# Altium project 磁导航.PrjPCB
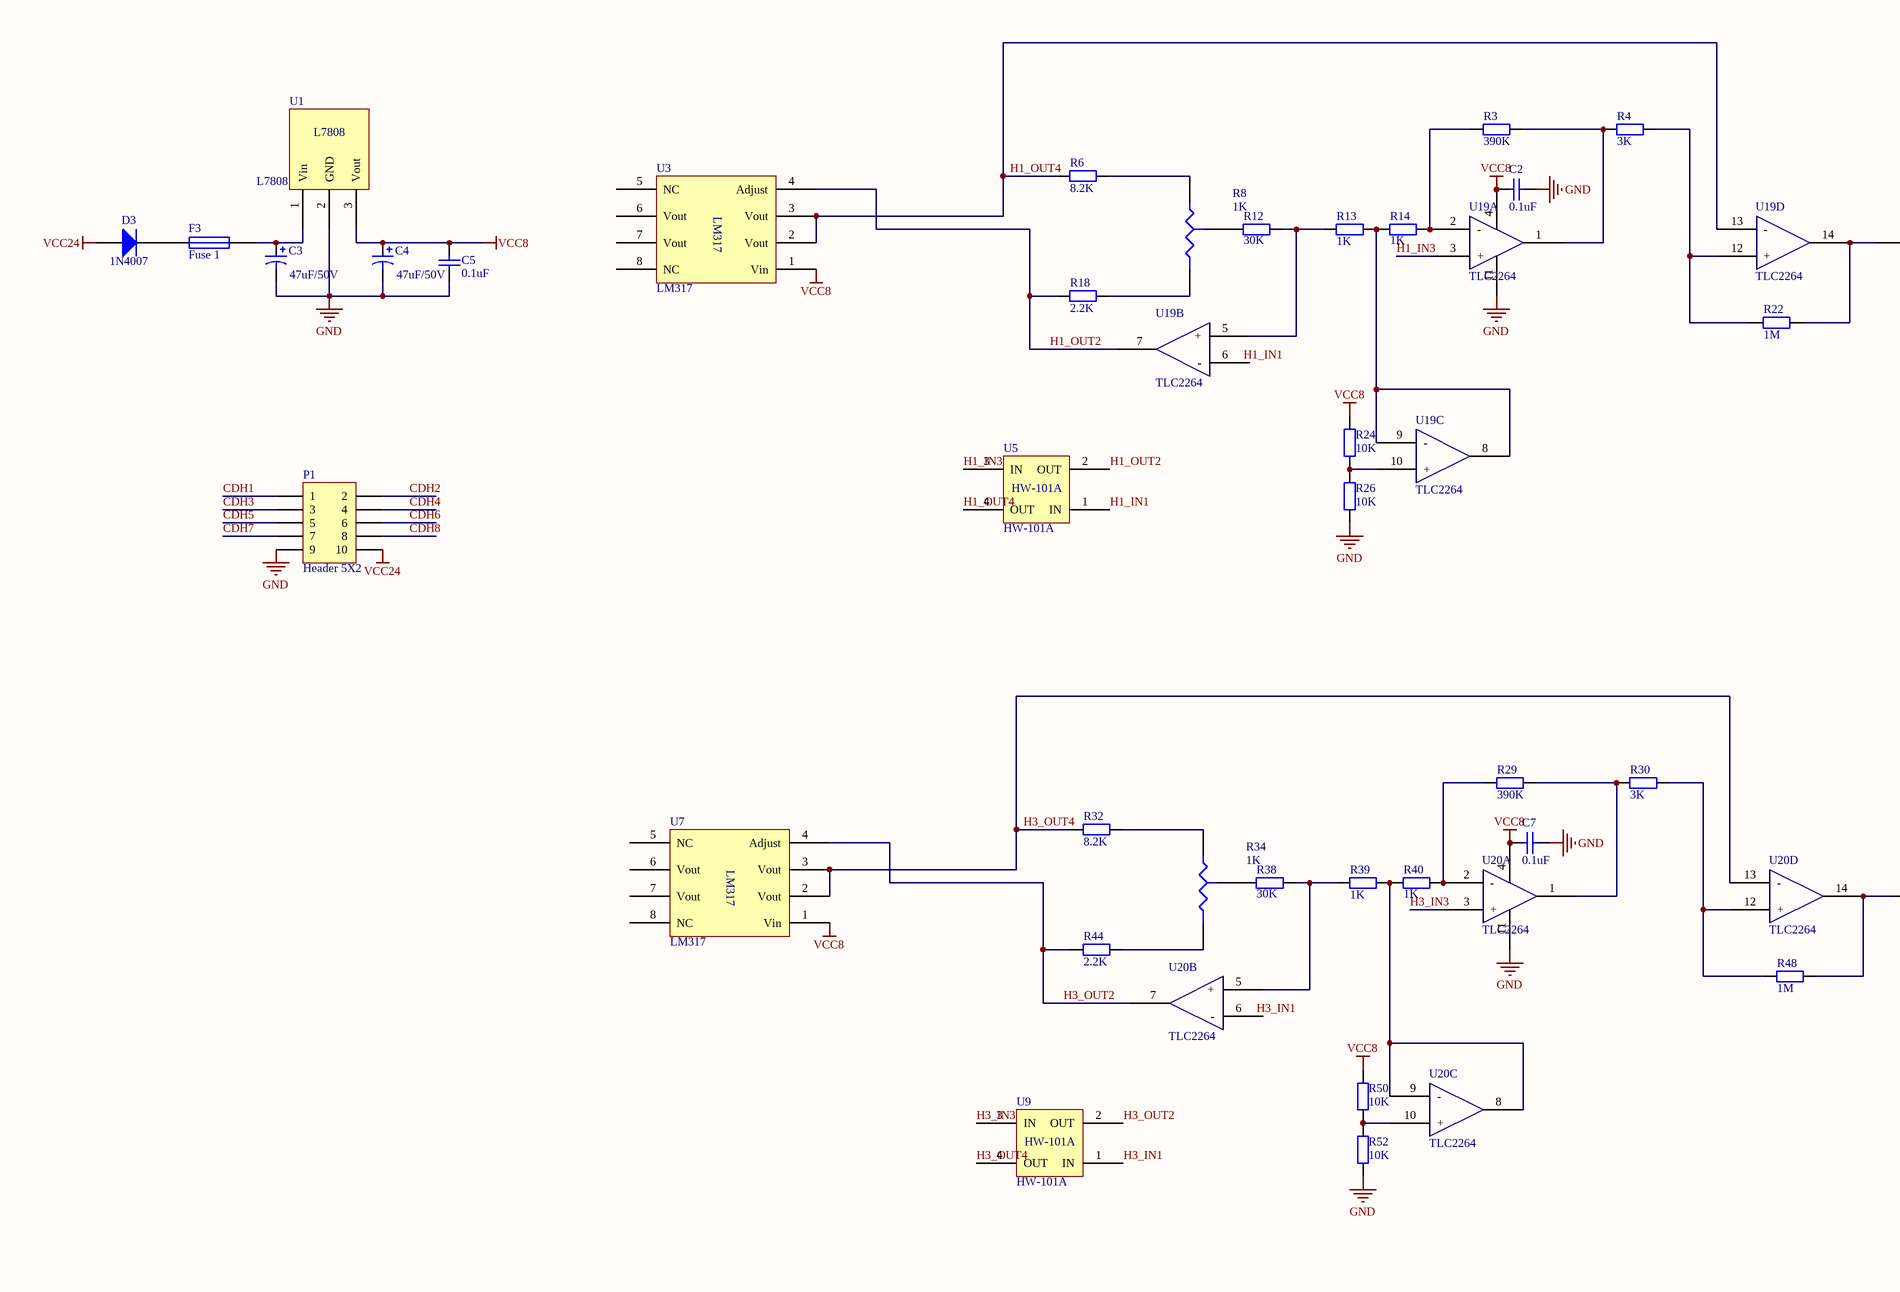
[diagram p0: 磁导航20161011.SchDoc, top left]
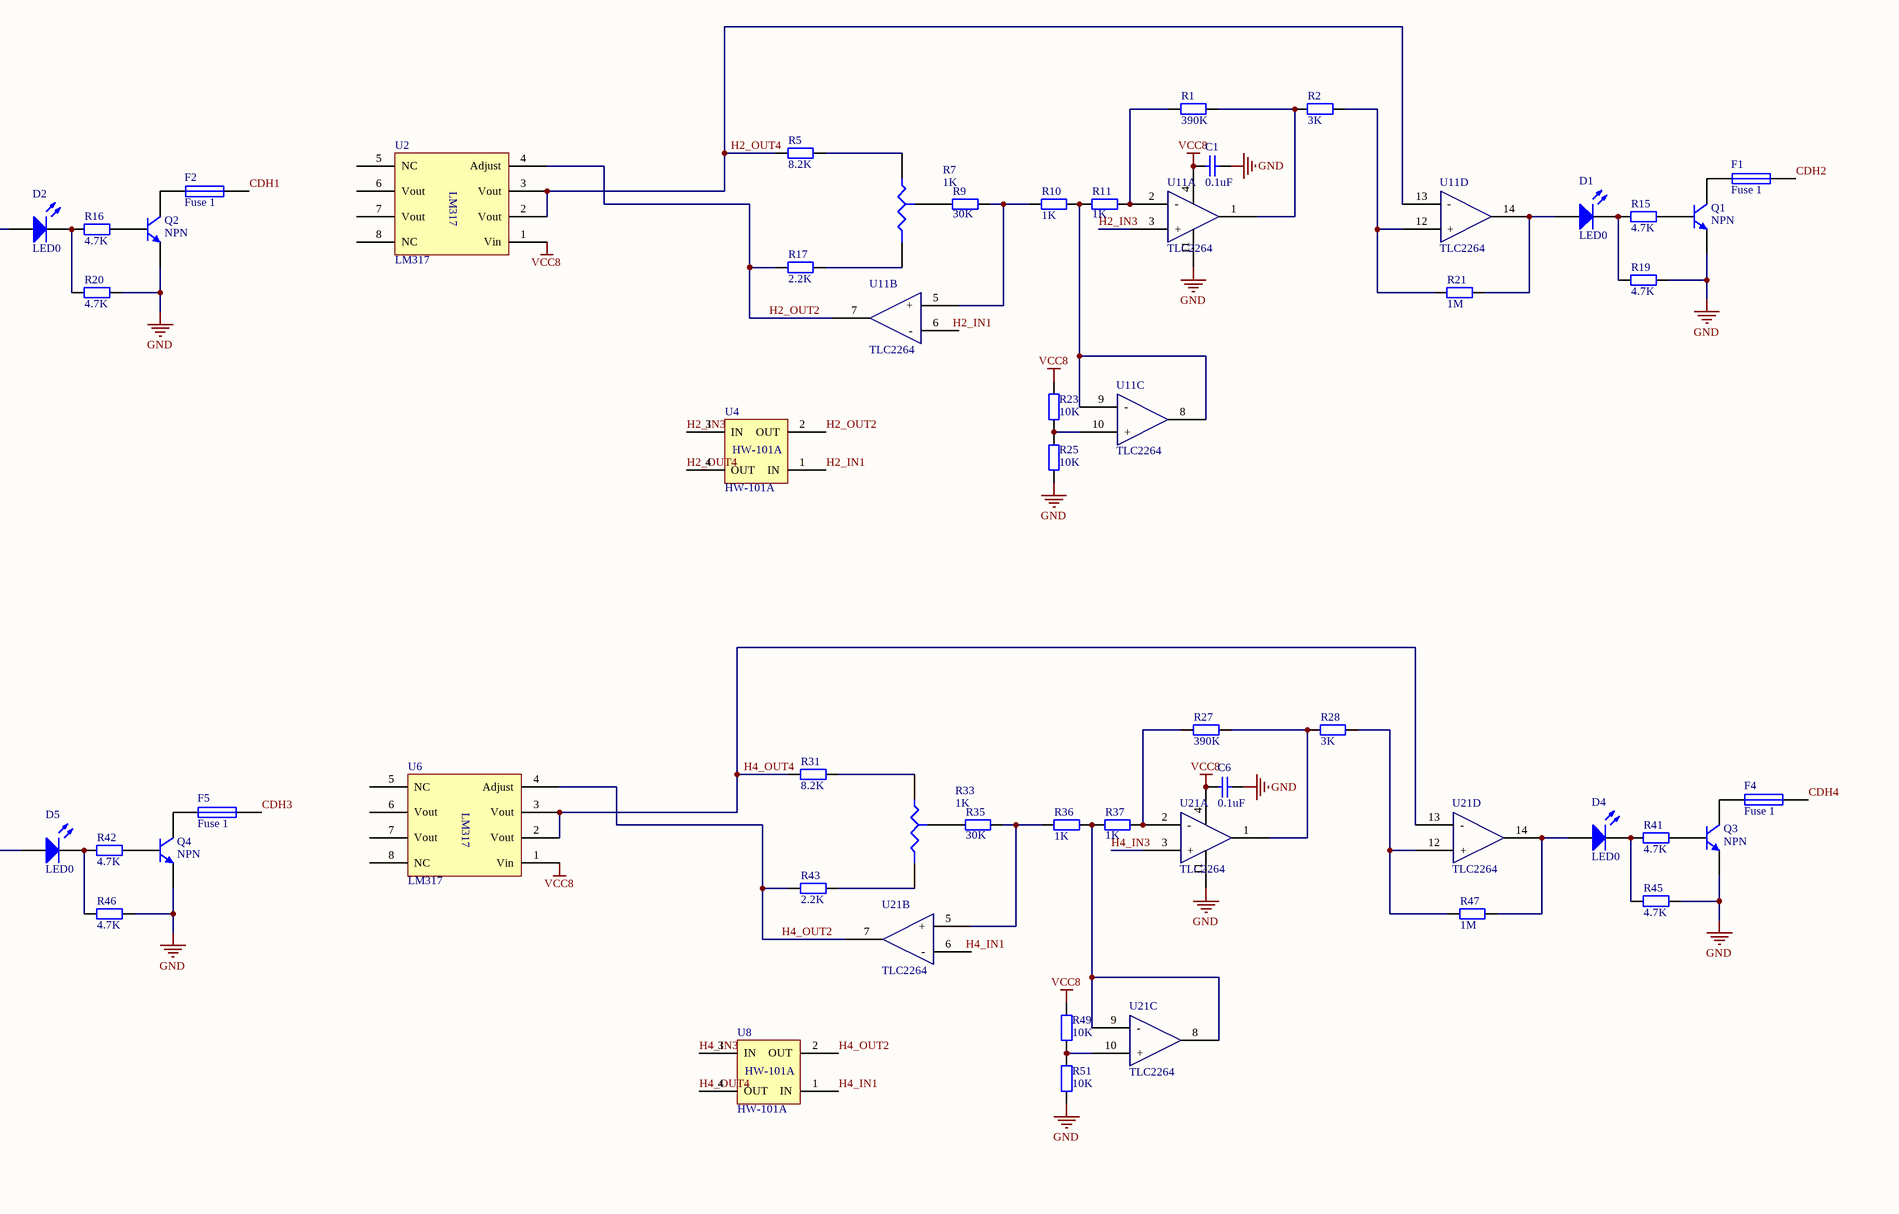
[diagram p1: 磁导航20161011.SchDoc, top right]
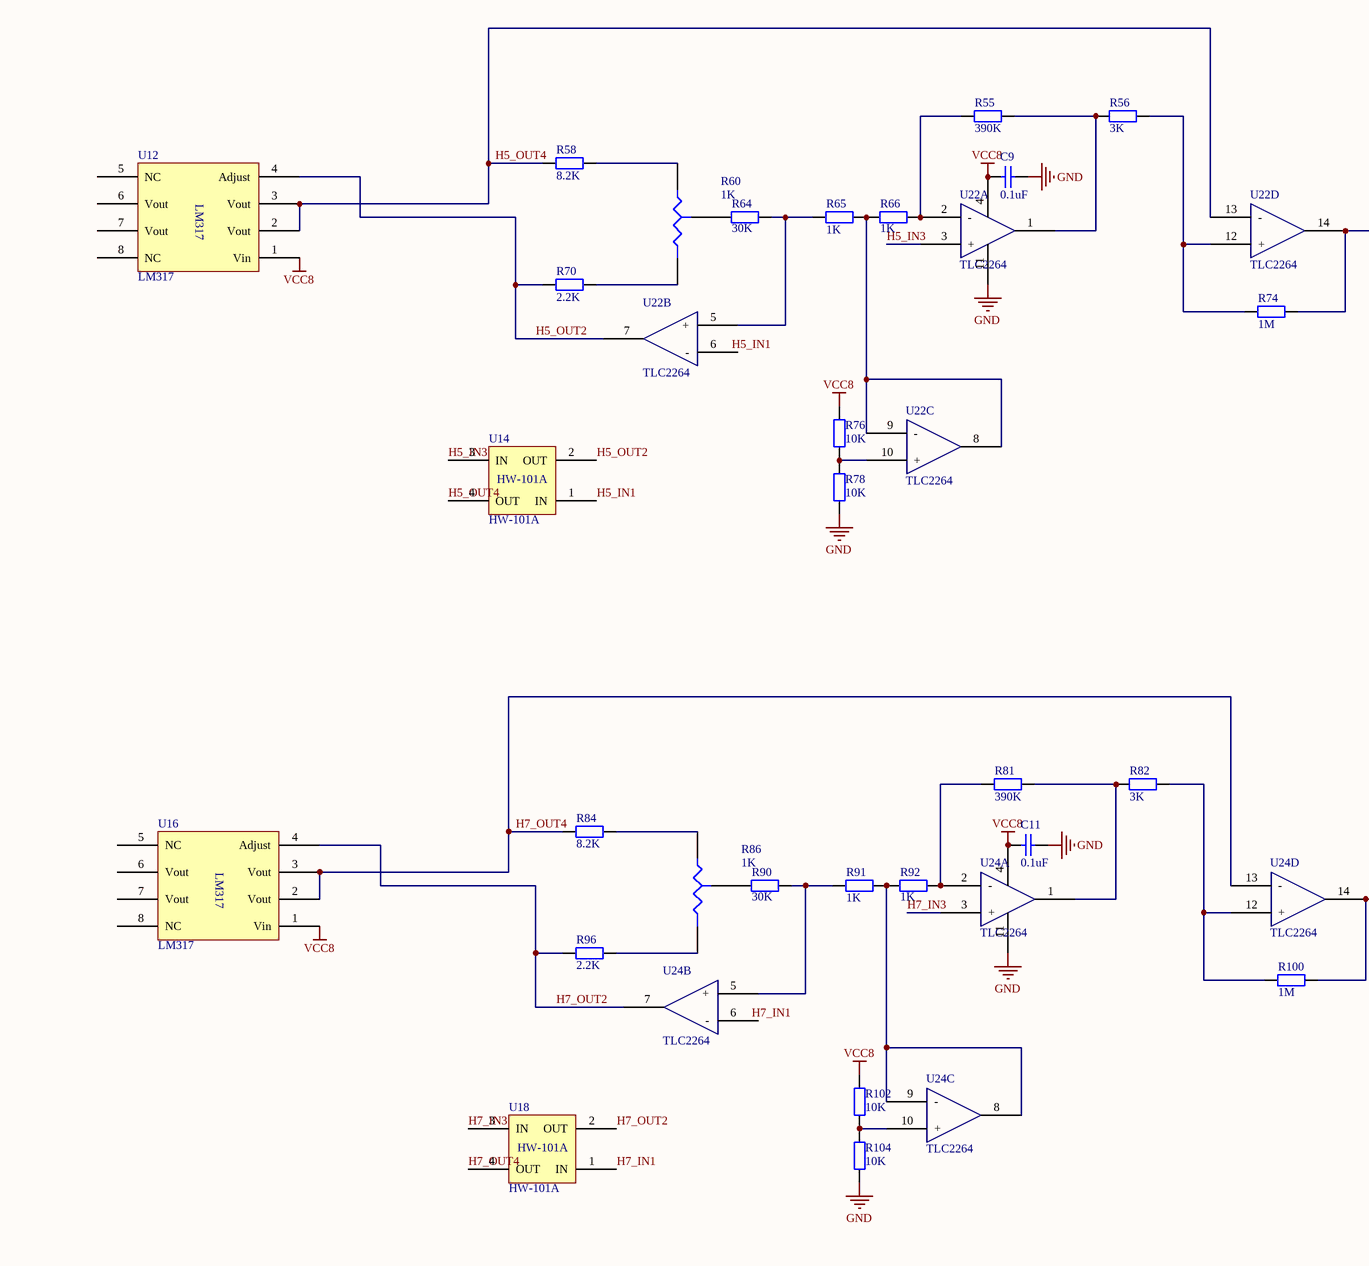
[diagram p2: 磁导航20161011.SchDoc, bottom left]
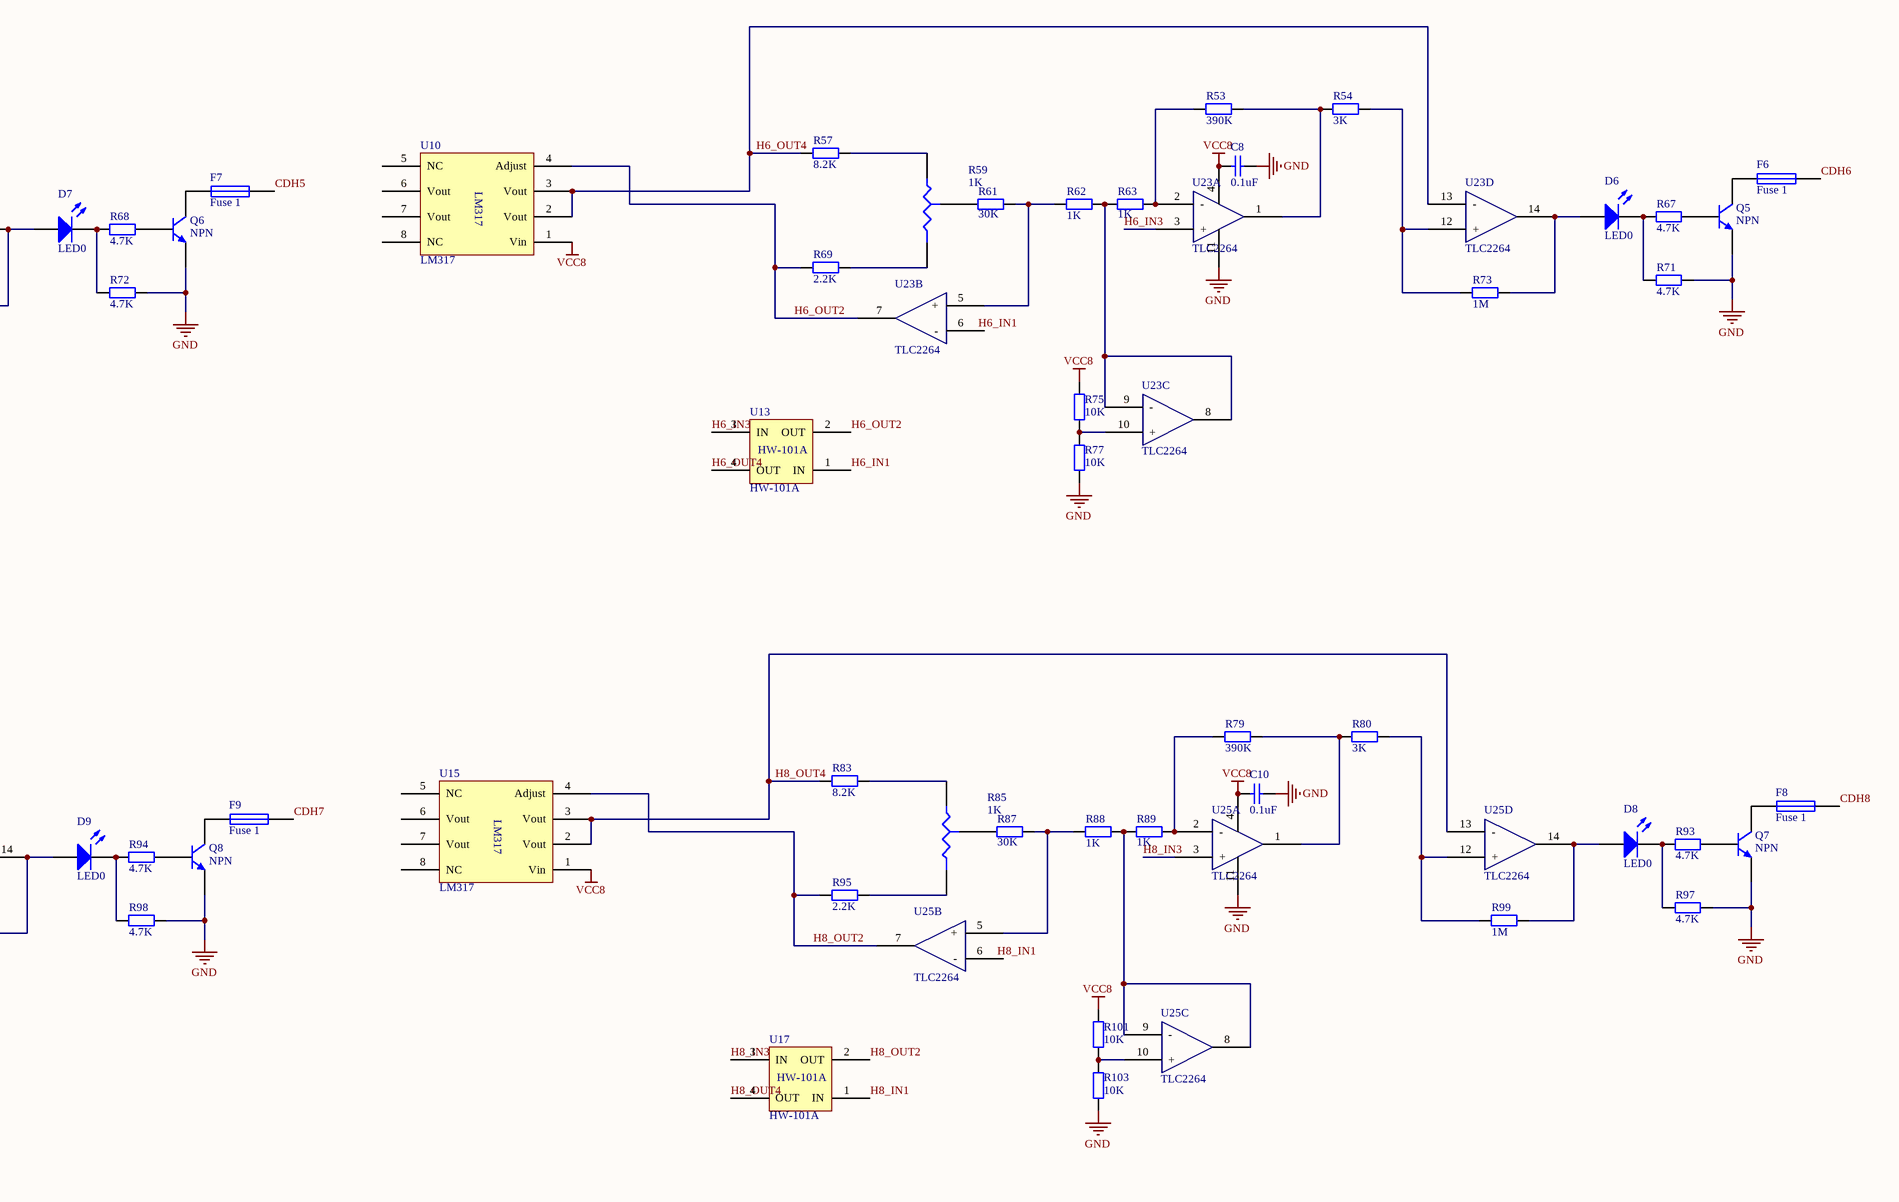
[diagram p3: 磁导航20161011.SchDoc, bottom right]
3 sheets, 334 parts. Net scope: hierarchical (ports join the sheet entries above them; power ports are global).
Board files: 磁导航.PcbDoc, 多通道.PcbDoc
Sheets:
  磁导航20161011.SchDoc
  总图.SchDoc
    cdh1 = cdh.SchDoc
    cdh2 = cdh.SchDoc
    cdh3 = cdh.SchDoc
    cdh4 = cdh.SchDoc
    cdh5 = cdh.SchDoc
    cdh6 = cdh.SchDoc
    cdh7 = cdh.SchDoc
    cdh8 = cdh.SchDoc

## Sheet 磁导航20161011.SchDoc
size A1

### Parts
(Parts that share a designator on the sheet are numbered #1, #2 ... from top to bottom, then left to right.)
C1  value 0.1uF  [C0805]  (hidden comment: Cap Semi)
C2  value 0.1uF  [C0805]  (hidden comment: Cap Semi)
C3#1  value 47uF/50V  [CAP-6*12]  (hidden comment: Cap Pol3)
C4#1  value 47uF/50V  [CAP-6*12]  (hidden comment: Cap Pol3)
C5#1  value 0.1uF  [C0805]  (hidden comment: Cap Semi)
C6  value 0.1uF  [C0805]  (hidden comment: Cap Semi)
C7  value 0.1uF  [C0805]  (hidden comment: Cap Semi)
C8  value 0.1uF  [C0805]  (hidden comment: Cap Semi)
C9  value 0.1uF  [C0805]  (hidden comment: Cap Semi)
C10  value 0.1uF  [C0805]  (hidden comment: Cap Semi)
C11  value 0.1uF  [C0805]  (hidden comment: Cap Semi)
D1  LED0  [LED1]
D2  LED0  [LED1]
D3#1  1N4007  [DIDOE]
D4  LED0  [LED1]
D5  LED0  [LED1]
D6  LED0  [LED1]
D7  LED0  [LED1]
D8  LED0  [LED1]
D9  LED0  [LED1]
F1  Fuse 1  [1206]
F2  Fuse 1  [1206]
F3#1  Fuse 1  [1206]
F4  Fuse 1  [1206]
F5  Fuse 1  [1206]
F6  Fuse 1  [1206]
F7  Fuse 1  [1206]
F8  Fuse 1  [1206]
F9  Fuse 1  [1206]
P1#1  Header 5X2  [HDR2X5]
Q1  NPN  [SOT-23]
Q2  NPN  [SOT-23]
Q3  NPN  [SOT-23]
Q4  NPN  [SOT-23]
Q5  NPN  [SOT-23]
Q6  NPN  [SOT-23]
Q7  NPN  [SOT-23]
Q8  NPN  [SOT-23]
R1  value 390K  [0805]  (hidden comment: Res2)
R2  value 3K  [0805]  (hidden comment: Res2)
R3  value 390K  [0805]  (hidden comment: Res2)
R4  value 3K  [0805]  (hidden comment: Res2)
R5  value 8.2K  [0805]  (hidden comment: Res2)
R6  value 8.2K  [0805]  (hidden comment: Res2)
R7  value 1K  [3224W]  (hidden comment: Res Tap)
R8  value 1K  [3224W]  (hidden comment: Res Tap)
R9  value 30K  [0805]  (hidden comment: Res2)
R10  value 1K  [0805]  (hidden comment: Res2)
R11  value 1K  [0805]  (hidden comment: Res2)
R12  value 30K  [0805]  (hidden comment: Res2)
R13  value 1K  [0805]  (hidden comment: Res2)
R14  value 1K  [0805]  (hidden comment: Res2)
R15  value 4.7K  [0805]  (hidden comment: Res2)
R16  value 4.7K  [0805]  (hidden comment: Res2)
R17  value 2.2K  [0805]  (hidden comment: Res2)
R18  value 2.2K  [0805]  (hidden comment: Res2)
R19  value 4.7K  [0805]  (hidden comment: Res2)
R20  value 4.7K  [0805]  (hidden comment: Res2)
R21  value 1M  [0805]  (hidden comment: Res2)
R22  value 1M  [0805]  (hidden comment: Res2)
R23  value 10K  [0805]  (hidden comment: Res2)
R24  value 10K  [0805]  (hidden comment: Res2)
R25  value 10K  [0805]  (hidden comment: Res2)
R26  value 10K  [0805]  (hidden comment: Res2)
R27  value 390K  [0805]  (hidden comment: Res2)
R28  value 3K  [0805]  (hidden comment: Res2)
R29  value 390K  [0805]  (hidden comment: Res2)
R30  value 3K  [0805]  (hidden comment: Res2)
R31  value 8.2K  [0805]  (hidden comment: Res2)
R32  value 8.2K  [0805]  (hidden comment: Res2)
R33  value 1K  [3224W]  (hidden comment: Res Tap)
R34  value 1K  [3224W]  (hidden comment: Res Tap)
R35  value 30K  [0805]  (hidden comment: Res2)
R36  value 1K  [0805]  (hidden comment: Res2)
R37  value 1K  [0805]  (hidden comment: Res2)
R38  value 30K  [0805]  (hidden comment: Res2)
R39  value 1K  [0805]  (hidden comment: Res2)
R40  value 1K  [0805]  (hidden comment: Res2)
R41  value 4.7K  [0805]  (hidden comment: Res2)
R42  value 4.7K  [0805]  (hidden comment: Res2)
R43  value 2.2K  [0805]  (hidden comment: Res2)
R44  value 2.2K  [0805]  (hidden comment: Res2)
R45  value 4.7K  [0805]  (hidden comment: Res2)
R46  value 4.7K  [0805]  (hidden comment: Res2)
R47  value 1M  [0805]  (hidden comment: Res2)
R48  value 1M  [0805]  (hidden comment: Res2)
R49  value 10K  [0805]  (hidden comment: Res2)
R50  value 10K  [0805]  (hidden comment: Res2)
R51  value 10K  [0805]  (hidden comment: Res2)
R52  value 10K  [0805]  (hidden comment: Res2)
R53  value 390K  [0805]  (hidden comment: Res2)
R54  value 3K  [0805]  (hidden comment: Res2)
R55  value 390K  [0805]  (hidden comment: Res2)
R56  value 3K  [0805]  (hidden comment: Res2)
R57  value 8.2K  [0805]  (hidden comment: Res2)
R58  value 8.2K  [0805]  (hidden comment: Res2)
R59  value 1K  [3224W]  (hidden comment: Res Tap)
R60  value 1K  [3224W]  (hidden comment: Res Tap)
R61  value 30K  [0805]  (hidden comment: Res2)
R62  value 1K  [0805]  (hidden comment: Res2)
R63  value 1K  [0805]  (hidden comment: Res2)
R64  value 30K  [0805]  (hidden comment: Res2)
R65  value 1K  [0805]  (hidden comment: Res2)
R66  value 1K  [0805]  (hidden comment: Res2)
R67  value 4.7K  [0805]  (hidden comment: Res2)
R68  value 4.7K  [0805]  (hidden comment: Res2)
R69  value 2.2K  [0805]  (hidden comment: Res2)
R70  value 2.2K  [0805]  (hidden comment: Res2)
R71  value 4.7K  [0805]  (hidden comment: Res2)
R72  value 4.7K  [0805]  (hidden comment: Res2)
R73  value 1M  [0805]  (hidden comment: Res2)
R74  value 1M  [0805]  (hidden comment: Res2)
R75  value 10K  [0805]  (hidden comment: Res2)
R76  value 10K  [0805]  (hidden comment: Res2)
R77  value 10K  [0805]  (hidden comment: Res2)
R78  value 10K  [0805]  (hidden comment: Res2)
R79  value 390K  [0805]  (hidden comment: Res2)
R80  value 3K  [0805]  (hidden comment: Res2)
R81  value 390K  [0805]  (hidden comment: Res2)
R82  value 3K  [0805]  (hidden comment: Res2)
R83  value 8.2K  [0805]  (hidden comment: Res2)
R84  value 8.2K  [0805]  (hidden comment: Res2)
R85  value 1K  [3224W]  (hidden comment: Res Tap)
R86  value 1K  [3224W]  (hidden comment: Res Tap)
R87  value 30K  [0805]  (hidden comment: Res2)
R88  value 1K  [0805]  (hidden comment: Res2)
R89  value 1K  [0805]  (hidden comment: Res2)
R90  value 30K  [0805]  (hidden comment: Res2)
R91  value 1K  [0805]  (hidden comment: Res2)
R92  value 1K  [0805]  (hidden comment: Res2)
R93  value 4.7K  [0805]  (hidden comment: Res2)
R94  value 4.7K  [0805]  (hidden comment: Res2)
R95  value 2.2K  [0805]  (hidden comment: Res2)
R96  value 2.2K  [0805]  (hidden comment: Res2)
R97  value 4.7K  [0805]  (hidden comment: Res2)
R98  value 4.7K  [0805]  (hidden comment: Res2)
R99  value 1M  [0805]  (hidden comment: Res2)
R100  value 1M  [0805]  (hidden comment: Res2)
R101  value 10K  [0805]  (hidden comment: Res2)
R102  value 10K  [0805]  (hidden comment: Res2)
R103  value 10K  [0805]  (hidden comment: Res2)
R104  value 10K  [0805]  (hidden comment: Res2)
U1#1  L7808  [TO-220]
U2  LM317  [SO-8]
U3  LM317  [SO-8]
U4  HW-101A  [SOT-23-4]
U5  HW-101A  [SOT-23-4]
U6  LM317  [SO-8]
U7  LM317  [SO-8]
U8  HW-101A  [SOT-23-4]
U9  HW-101A  [SOT-23-4]
U10  LM317  [SO-8]
U11  TLC2264  [TSSOP14]  (parts A,B,C,D of 4)
U12  LM317  [SO-8]
U13  HW-101A  [SOT-23-4]
U14  HW-101A  [SOT-23-4]
U15  LM317  [SO-8]
U16  LM317  [SO-8]
U17  HW-101A  [SOT-23-4]
U18  HW-101A  [SOT-23-4]
U19  TLC2264  [TSSOP14]  (parts A,B,C,D of 4)
U20  TLC2264  [TSSOP14]  (parts A,B,C,D of 4)
U21  TLC2264  [TSSOP14]  (parts A,B,C,D of 4)
U22  TLC2264  [TSSOP14]  (parts A,B,C,D of 4)
U23  TLC2264  [TSSOP14]  (parts A,B,C,D of 4)
U24  TLC2264  [TSSOP14]  (parts A,B,C,D of 4)
U25  TLC2264  [TSSOP14]  (parts A,B,C,D of 4)

### Nets
GND: C1.1 C2.1 C3#1.2 C4#1.2 C5#1.1 C6.1 C7.1 C8.1 C9.1 C10.1 C11.1 P1#1.9 Q1.3(E) Q2.3(E) Q3.3(E) Q4.3(E) Q5.3(E) Q6.3(E) Q7.3(E) Q8.3(E) R19.2 R20.2 R25.1 R26.1 R45.2 R46.2 R51.1 R52.1 R71.2 R72.2 R77.1 R78.1 R97.2 R98.2 R103.1 R104.1 U1#1.2(GND) U11.11(GND) U19.11(GND) U20.11(GND) U21.11(GND) U22.11(GND) U23.11(GND) U24.11(GND) U25.11(GND)
VCC8: C1.2 C2.2 C4#1.1 C5#1.2 C6.2 C7.2 C8.2 C9.2 C10.2 C11.2 R23.2 R24.2 R49.2 R50.2 R75.2 R76.2 R101.2 R102.2 U1#1.3(Vout) U2.1(Vin) U3.1(Vin) U6.1(Vin) U7.1(Vin) U10.1(Vin) U11.4(VCC) U12.1(Vin) U15.1(Vin) U16.1(Vin) U19.4(VCC) U20.4(VCC) U21.4(VCC) U22.4(VCC) U23.4(VCC) U24.4(VCC) U25.4(VCC)
VCC24: D3#1.1(A) P1#1.10
CDH1: F2.2 P1#1.1
CDH2: F1.2 P1#1.2
CDH3: F5.2 P1#1.3
CDH4: F4.2 P1#1.4
CDH5: F7.2 P1#1.5
CDH6: F6.2 P1#1.6
CDH7: F9.2 P1#1.7
CDH8: F8.2 P1#1.8
H1_IN1: U5.1(IN)
H1_IN3: U5.3(IN) U19.3(+)
H1_OUT2: R18.1 U3.4(Adjust) U5.2(OUT) U19.7(2OUT)
H1_OUT4: R6.1 U3.2(Vout) U3.3(Vout) U5.4(OUT) U19.13(-)
H2_IN1: U4.1(IN)
H2_IN3: U4.3(IN) U11.3(+)
H2_OUT2: R17.1 U2.4(Adjust) U4.2(OUT) U11.7(2OUT)
H2_OUT4: R5.1 U2.2(Vout) U2.3(Vout) U4.4(OUT) U11.13(-)
H3_IN1: U9.1(IN)
H3_IN3: U9.3(IN) U20.3(+)
H3_OUT2: R44.1 U7.4(Adjust) U9.2(OUT) U20.7(2OUT)
H3_OUT4: R32.1 U7.2(Vout) U7.3(Vout) U9.4(OUT) U20.13(-)
H4_IN1: U8.1(IN)
H4_IN3: U8.3(IN) U21.3(+)
H4_OUT2: R43.1 U6.4(Adjust) U8.2(OUT) U21.7(2OUT)
H4_OUT4: R31.1 U6.2(Vout) U6.3(Vout) U8.4(OUT) U21.13(-)
H5_IN1: U14.1(IN)
H5_IN3: U14.3(IN) U22.3(+)
H5_OUT2: R70.1 U12.4(Adjust) U14.2(OUT) U22.7(2OUT)
H5_OUT4: R58.1 U12.2(Vout) U12.3(Vout) U14.4(OUT) U22.13(-)
H6_IN1: U13.1(IN)
H6_IN3: U13.3(IN) U23.3(+)
H6_OUT2: R69.1 U10.4(Adjust) U13.2(OUT) U23.7(2OUT)
H6_OUT4: R57.1 U10.2(Vout) U10.3(Vout) U13.4(OUT) U23.13(-)
H7_IN1: U18.1(IN)
H7_IN3: U18.3(IN) U24.3(+)
H7_OUT2: R96.1 U16.4(Adjust) U18.2(OUT) U24.7(2OUT)
H7_OUT4: R84.1 U16.2(Vout) U16.3(Vout) U18.4(OUT) U24.13(-)
H8_IN1: U17.1(IN)
H8_IN3: U17.3(IN) U25.3(+)
H8_OUT2: R95.1 U15.4(Adjust) U17.2(OUT) U25.7(2OUT)
H8_OUT4: R83.1 U15.2(Vout) U15.3(Vout) U17.4(OUT) U25.13(-)
NetC3#1_1: C3#1.1 F3#1.2 U1#1.1(Vin)
NetD1_1: D1.1(A) R21.2 U11.14(4OUT)
NetD1_2: D1.2(K) R15.1 R19.1
NetD2_1: D2.1(A) R22.2 U19.14(4OUT)
NetD2_2: D2.2(K) R16.1 R20.1
NetD3#1_2: D3#1.2(K) F3#1.1
NetD4_1: D4.1(A) R47.2 U21.14(4OUT)
NetD4_2: D4.2(K) R41.1 R45.1
NetD5_1: D5.1(A) R48.2 U20.14(4OUT)
NetD5_2: D5.2(K) R42.1 R46.1
NetD6_1: D6.1(A) R73.2 U23.14(4OUT)
NetD6_2: D6.2(K) R67.1 R71.1
NetD7_1: D7.1(A) R74.2 U22.14(4OUT)
NetD7_2: D7.2(K) R68.1 R72.1
NetD8_1: D8.1(A) R99.2 U25.14(4OUT)
NetD8_2: D8.2(K) R93.1 R97.1
NetD9_1: D9.1(A) R100.2 U24.14(4OUT)
NetD9_2: D9.2(K) R94.1 R98.1
NetF1_1: F1.1 Q1.1(C)
NetF2_1: F2.1 Q2.1(C)
NetF4_1: F4.1 Q3.1(C)
NetF5_1: F5.1 Q4.1(C)
NetF6_1: F6.1 Q5.1(C)
NetF7_1: F7.1 Q6.1(C)
NetF8_1: F8.1 Q7.1(C)
NetF9_1: F9.1 Q8.1(C)
NetQ1_2: Q1.2(B) R15.2
NetQ2_2: Q2.2(B) R16.2
NetQ3_2: Q3.2(B) R41.2
NetQ4_2: Q4.2(B) R42.2
NetQ5_2: Q5.2(B) R67.2
NetQ6_2: Q6.2(B) R68.2
NetQ7_2: Q7.2(B) R93.2
NetQ8_2: Q8.2(B) R94.2
NetR1_1: R1.1 R11.1 U11.2(-)
NetR1_2: R1.2 R2.1 U11.1(1OUT)
NetR2_2: R2.2 R21.1 U11.12(+)
NetR3_1: R3.1 R14.1 U19.2(-)
NetR3_2: R3.2 R4.1 U19.1(1OUT)
NetR4_2: R4.2 R22.1 U19.12(+)
NetR5_2: R5.2 R7.1(A)
NetR6_2: R6.2 R8.1(A)
NetR7_2: R7.2(B) R17.2
NetR7_3: R7.3(TAP) R9.1
NetR8_2: R8.2(B) R18.2
NetR8_3: R8.3(TAP) R12.1
NetR9_2: R9.2 R10.1 U11.5(+)
NetR10_2: R10.2 R11.2 U11.8(3OUT) U11.9(-)
NetR12_2: R12.2 R13.1 U19.5(+)
NetR13_2: R13.2 R14.2 U19.8(3OUT) U19.9(-)
NetR23_1: R23.1 R25.2 U11.10(+)
NetR24_1: R24.1 R26.2 U19.10(+)
NetR27_1: R27.1 R37.1 U21.2(-)
NetR27_2: R27.2 R28.1 U21.1(1OUT)
NetR28_2: R28.2 R47.1 U21.12(+)
NetR29_1: R29.1 R40.1 U20.2(-)
NetR29_2: R29.2 R30.1 U20.1(1OUT)
NetR30_2: R30.2 R48.1 U20.12(+)
NetR31_2: R31.2 R33.1(A)
NetR32_2: R32.2 R34.1(A)
NetR33_2: R33.2(B) R43.2
NetR33_3: R33.3(TAP) R35.1
NetR34_2: R34.2(B) R44.2
NetR34_3: R34.3(TAP) R38.1
NetR35_2: R35.2 R36.1 U21.5(+)
NetR36_2: R36.2 R37.2 U21.8(3OUT) U21.9(-)
NetR38_2: R38.2 R39.1 U20.5(+)
NetR39_2: R39.2 R40.2 U20.8(3OUT) U20.9(-)
NetR49_1: R49.1 R51.2 U21.10(+)
NetR50_1: R50.1 R52.2 U20.10(+)
NetR53_1: R53.1 R63.1 U23.2(-)
NetR53_2: R53.2 R54.1 U23.1(1OUT)
NetR54_2: R54.2 R73.1 U23.12(+)
NetR55_1: R55.1 R66.1 U22.2(-)
NetR55_2: R55.2 R56.1 U22.1(1OUT)
NetR56_2: R56.2 R74.1 U22.12(+)
NetR57_2: R57.2 R59.1(A)
NetR58_2: R58.2 R60.1(A)
NetR59_2: R59.2(B) R69.2
NetR59_3: R59.3(TAP) R61.1
NetR60_2: R60.2(B) R70.2
NetR60_3: R60.3(TAP) R64.1
NetR61_2: R61.2 R62.1 U23.5(+)
NetR62_2: R62.2 R63.2 U23.8(3OUT) U23.9(-)
NetR64_2: R64.2 R65.1 U22.5(+)
NetR65_2: R65.2 R66.2 U22.8(3OUT) U22.9(-)
NetR75_1: R75.1 R77.2 U23.10(+)
NetR76_1: R76.1 R78.2 U22.10(+)
NetR79_1: R79.1 R89.1 U25.2(-)
NetR79_2: R79.2 R80.1 U25.1(1OUT)
NetR80_2: R80.2 R99.1 U25.12(+)
NetR81_1: R81.1 R92.1 U24.2(-)
NetR81_2: R81.2 R82.1 U24.1(1OUT)
NetR82_2: R82.2 R100.1 U24.12(+)
NetR83_2: R83.2 R85.1(A)
NetR84_2: R84.2 R86.1(A)
NetR85_2: R85.2(B) R95.2
NetR85_3: R85.3(TAP) R87.1
NetR86_2: R86.2(B) R96.2
NetR86_3: R86.3(TAP) R90.1
NetR87_2: R87.2 R88.1 U25.5(+)
NetR88_2: R88.2 R89.2 U25.8(3OUT) U25.9(-)
NetR90_2: R90.2 R91.1 U24.5(+)
NetR91_2: R91.2 R92.2 U24.8(3OUT) U24.9(-)
NetR101_1: R101.1 R103.2 U25.10(+)
NetR102_1: R102.1 R104.2 U24.10(+)

Not connected (* = marked no-connect by the designer): U2 5(NC) 6(Vout) 7(Vout) 8(NC); U3 5(NC) 6(Vout) 7(Vout) 8(NC); U6 5(NC) 6(Vout) 7(Vout) 8(NC); U7 5(NC) 6(Vout) 7(Vout) 8(NC); U10 5(NC) 6(Vout) 7(Vout) 8(NC); U11 6(-); U12 5(NC) 6(Vout) 7(Vout) 8(NC); U15 5(NC) 6(Vout) 7(Vout) 8(NC); U16 5(NC) 6(Vout) 7(Vout) 8(NC); U19 6(-); U20 6(-); U21 6(-); U22 6(-); U23 6(-); U24 6(-); U25 6(-)

### Notes on the sheet
- Labels drawn without touching a wire or pin: H1_IN1, H2_IN1, H3_IN1, H4_IN1, H5_IN1, H6_IN1, H7_IN1, H8_IN1

### Library data of the parts
C1 C2 C5#1 C6-C11 = Cap Semi: Capacitor (Semiconductor SIM Model); Published: 8-Jun-2000; LatestRevisionDate: 29-May-2009; LatestRevisionNote: IPC-7351 Footprint Added.; PackageReference: C1206; Publisher: Altium Limited; PackageDescription: Chip Capacitor
C3#1 C4#1 = Cap Pol3: Polarized Capacitor (Surface Mount); Published: 8-Jun-2000; LatestRevisionDate: 29-May-2009; LatestRevisionNote: IPC-7351 Footprint Added.; PackageReference: C0805; Publisher: Altium Limited; PackageDescription: Chip Capacitor
D1 D2 D4-D9 = LED0: Typical INFRARED GaAs LED; Published: 8-Jun-2000; LatestRevisionDate: 08-Jul-2005; LatestRevisionNote: Mech Layer 1 removed.; PackageReference: LED-0; Publisher: Altium Limited; PackageDescription: LED; 2 Leads
D3#1 = Diode 1N4007: 1 Amp General Purpose Rectifier; Published: 8-Jun-2000; LatestRevisionDate: 17-Jul-2002; LatestRevisionNote: Re-released for DXP Platform.; DatasheetVersion: 1998; PackageVersion: Aug-1999; PackageReference: DO-41; Publisher: Altium Limited; PackageDescription: Diode, Axial; Body 5.2 x 2.7 mm (LxDia. max), Lead Dia. 0.86 mm (max); Code_JEDEC: DO-204-AL; ComponentLink1Description: Manufacturer Link; ComponentLink1URL: http://www.fairchildsemi.com/; ComponentLink2Description: Datasheet; ComponentLink2URL: http://www.fairchildsemi.com/ds/1N%2F1N4001.pdf
F1 F2 F3#1 F4-F9 = Fuse 1: Fuse; Published: 8-Jun-2000; LatestRevisionDate: 17-Jul-2002; LatestRevisionNote: Re-released for DXP Platform.; PackageReference: PIN-W2/E2.8; Publisher: Altium Limited; PackageDescription: Thru-Hole; 2 Leads
P1#1 = Header 5X2: Header, 5-Pin, Dual row; LatestRevisionDate: 17-Jul-2002; LatestRevisionNote: Re-released for DXP Platform.; Publisher: Altium Limited
Q1-Q8 = NPN: NPN Bipolar Transistor; Published: 8-Jun-2000; LatestRevisionDate: 17-Jul-2002; LatestRevisionNote: Re-released for DXP Platform.; PackageReference: TO-226-AA; Publisher: Altium Limited; PackageDescription: TO, Flat Index; 3 In-Line, Axial Leads; Body Dia. 4.8mm; Leads 0.55 x 0.51 mm (max); Code_JEDEC: TO-226-AA
R1-R6 R9-R32 R35-R58 R61-R84 R87-R104 = Res2: Resistor; Published: 8-Jun-2000; LatestRevisionDate: 17-Jul-2002; LatestRevisionNote: Re-released for DXP Platform.; PackageReference: AXIAL-0.4; Publisher: Altium Limited; PackageDescription: Axial Device, Thru-Hole; 2 Leads; 0.4 in Pin Spacing
R7 R8 R33 R34 R59 R60 R85 R86 = Res Tap: Tapped Resistor; Sim Note: Enter the Resistance value and the set point into parameter fields.; Set Position: 0.5; Published: 24-Mar-1999; LatestRevisionDate: 17-Jul-2002; LatestRevisionNote: Re-released for DXP Platform.; PackageReference: VR3; Publisher: Altium Limited; PackageDescription: Variable Resistor, Thru-Hole; 3 Leads

## Sheet 总图.SchDoc
size A4
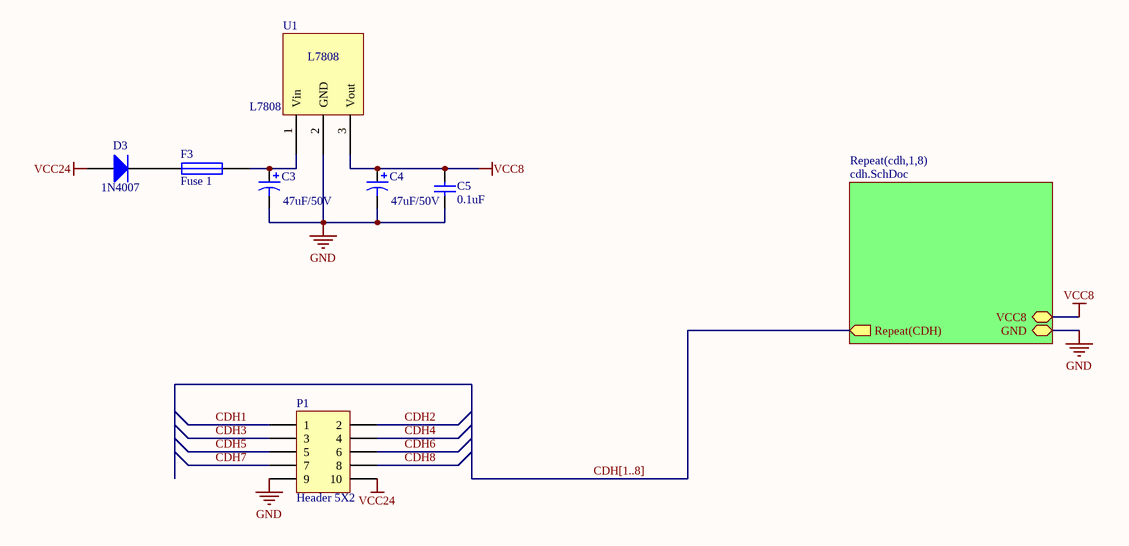
[diagram p4: 总图.SchDoc]

### Parts
(Parts that share a designator on the sheet are numbered #1, #2 ... from top to bottom, then left to right.)
C3#2  value 47uF/50V  [CAP-6*12]  (hidden comment: Cap Pol3)
C4#2  value 47uF/50V  [CAP-6*12]  (hidden comment: Cap Pol3)
C5#2  value 0.1uF  [C0805]  (hidden comment: Cap Semi)
D3#2  1N4007  [DIDOE]
F3#2  Fuse 1  [1206]
P1#2  Header 5X2  [HDR2X5]
U1#2  L7808  [TO-220]

### Sub-sheets
Repeat(cdh,1,8) = cdh.SchDoc: GND (bidir), VCC8 (bidir), Repeat(CDH) (out)

### Nets
GND: C3#2.2 C4#2.2 C5#2.1 P1#2.9 U1#2.2(GND) ; sheet Repeat(cdh,1,8)/GND
VCC8: C4#2.1 C5#2.2 U1#2.3(Vout) ; sheet Repeat(cdh,1,8)/VCC8
VCC24: D3#2.1(A) P1#2.10
CDH1: P1#2.1
CDH2: P1#2.2
CDH3: P1#2.3
CDH4: P1#2.4
CDH5: P1#2.5
CDH6: P1#2.6
CDH7: P1#2.7
CDH8: P1#2.8
NetC3#2_1: C3#2.1 F3#2.2 U1#2.1(Vin)
NetD3#2_2: D3#2.2(K) F3#2.1

### Buses and harness runs
bus CDH[1..8]

### Library data of the parts
C3#2 C4#2 = Cap Pol3: Polarized Capacitor (Surface Mount); Published: 8-Jun-2000; LatestRevisionDate: 29-May-2009; LatestRevisionNote: IPC-7351 Footprint Added.; PackageReference: C0805; Publisher: Altium Limited; PackageDescription: Chip Capacitor
C5#2 = Cap Semi: Capacitor (Semiconductor SIM Model); Published: 8-Jun-2000; LatestRevisionDate: 29-May-2009; LatestRevisionNote: IPC-7351 Footprint Added.; PackageReference: C1206; Publisher: Altium Limited; PackageDescription: Chip Capacitor
D3#2 = Diode 1N4007: 1 Amp General Purpose Rectifier; Published: 8-Jun-2000; LatestRevisionDate: 17-Jul-2002; LatestRevisionNote: Re-released for DXP Platform.; DatasheetVersion: 1998; PackageVersion: Aug-1999; PackageReference: DO-41; Publisher: Altium Limited; PackageDescription: Diode, Axial; Body 5.2 x 2.7 mm (LxDia. max), Lead Dia. 0.86 mm (max); Code_JEDEC: DO-204-AL; ComponentLink1Description: Manufacturer Link; ComponentLink1URL: http://www.fairchildsemi.com/; ComponentLink2Description: Datasheet; ComponentLink2URL: http://www.fairchildsemi.com/ds/1N%2F1N4001.pdf
F3#2 = Fuse 1: Fuse; Published: 8-Jun-2000; LatestRevisionDate: 17-Jul-2002; LatestRevisionNote: Re-released for DXP Platform.; PackageReference: PIN-W2/E2.8; Publisher: Altium Limited; PackageDescription: Thru-Hole; 2 Leads
P1#2 = Header 5X2: Header, 5-Pin, Dual row; LatestRevisionDate: 17-Jul-2002; LatestRevisionNote: Re-released for DXP Platform.; Publisher: Altium Limited

## Sheet cdh.SchDoc
size A3
Used 8 times, as channels cdh1, cdh2, cdh3, cdh4, cdh5, cdh6, cdh7, cdh8. Parts and nets are listed once, with the designators drawn on the sheet.
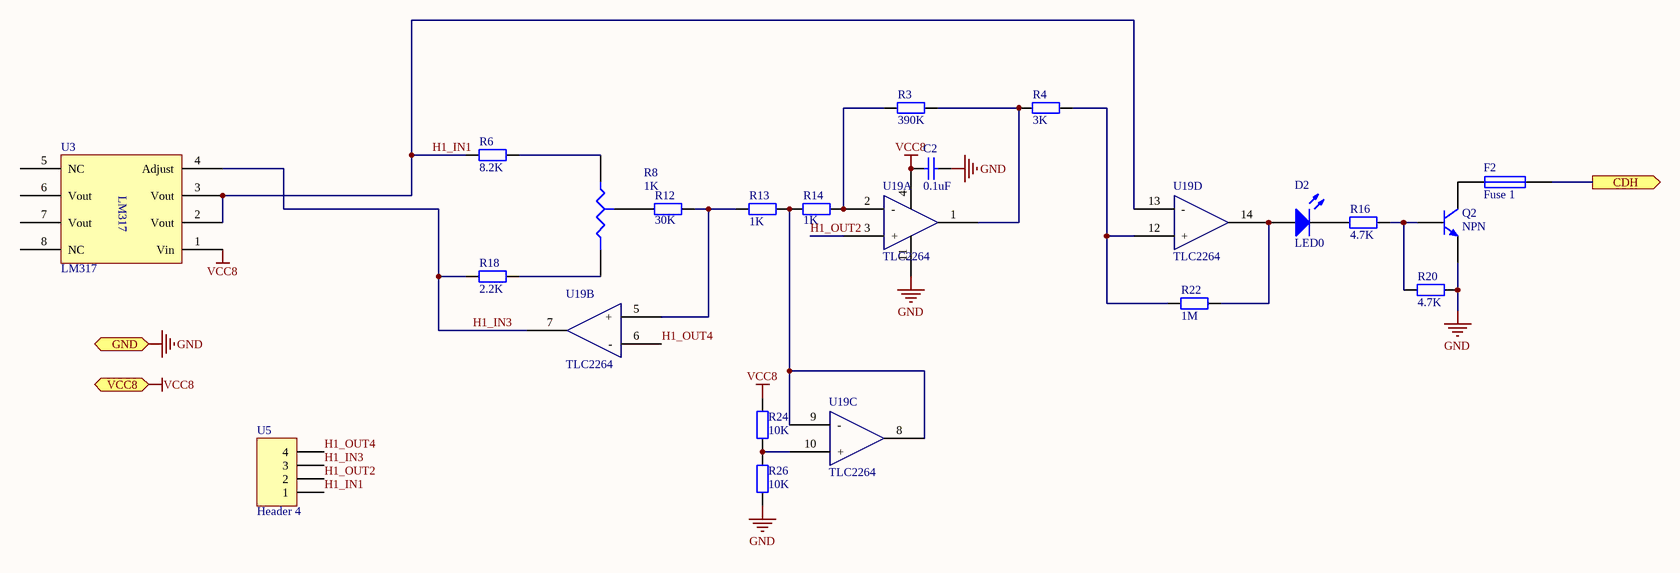
[diagram p5: cdh.SchDoc]

### Parts
C2  value 0.1uF  [C0805]  (hidden comment: Cap Semi)
D2  LED0  [LED1]
F2  Fuse 1  [1206]
Q2  NPN  [SOT-23]
R3  value 390K  [0805]  (hidden comment: Res2)
R4  value 3K  [0805]  (hidden comment: Res2)
R6  value 8.2K  [0805]  (hidden comment: Res2)
R8  value 1K  [3224W]  (hidden comment: Res Tap)
R12  value 30K  [0805]  (hidden comment: Res2)
R13  value 1K  [0805]  (hidden comment: Res2)
R14  value 1K  [0805]  (hidden comment: Res2)
R16  value 4.7K  [0805]  (hidden comment: Res2)
R18  value 2.2K  [0805]  (hidden comment: Res2)
R20  value 4.7K  [0805]  (hidden comment: Res2)
R22  value 1M  [0805]  (hidden comment: Res2)
R24  value 10K  [0805]  (hidden comment: Res2)
R26  value 10K  [0805]  (hidden comment: Res2)
U3  LM317  [SO-8]
U5  Header 4  [PIN4]
U19  TLC2264  [TSSOP14]  (parts A,B,C,D of 4)

### Ports
CDH (out), GND (bidir), VCC8 (bidir)

### Nets
GND: C2.1 Q2.3(E) R20.2 R26.1 U19.11(GND) ; port GND
VCC8: C2.2 R24.2 U3.1(Vin) U19.4(VCC) ; port VCC8
CDH: F2.2 ; port CDH
H1_IN1: R6.1 U3.2(Vout) U3.3(Vout) U5.1 U19.13(-)
H1_IN3: R18.1 U3.4(Adjust) U5.3 U19.7(2OUT)
H1_OUT2: U5.2 U19.3(+)
H1_OUT4: U5.4 U19.6(-)
NetD2_1: D2.1(A) R22.2 U19.14(4OUT)
NetD2_2: D2.2(K) R16.1
NetF2_1: F2.1 Q2.1(C)
NetQ2_2: Q2.2(B) R16.2 R20.1
NetR3_1: R3.1 R14.1 U19.2(-)
NetR3_2: R3.2 R4.1 U19.1(1OUT)
NetR4_2: R4.2 R22.1 U19.12(+)
NetR6_2: R6.2 R8.1(A)
NetR8_2: R8.2(B) R18.2
NetR8_3: R8.3(TAP) R12.1
NetR12_2: R12.2 R13.1 U19.5(+)
NetR13_2: R13.2 R14.2 U19.8(3OUT) U19.9(-)
NetR24_1: R24.1 R26.2 U19.10(+)

Not connected (* = marked no-connect by the designer): U3 5(NC) 6(Vout) 7(Vout) 8(NC)

### Channels
cdh1: designators end in _cdh1; ports CDH=NetF2_cdh1_2 GND=GND VCC8=VCC8
cdh2: designators end in _cdh2; ports CDH=NetF2_cdh2_2 GND=GND VCC8=VCC8
cdh3: designators end in _cdh3; ports CDH=NetF2_cdh3_2 GND=GND VCC8=VCC8
cdh4: designators end in _cdh4; ports CDH=NetF2_cdh4_2 GND=GND VCC8=VCC8
cdh5: designators end in _cdh5; ports CDH=NetF2_cdh5_2 GND=GND VCC8=VCC8
cdh6: designators end in _cdh6; ports CDH=NetF2_cdh6_2 GND=GND VCC8=VCC8
cdh7: designators end in _cdh7; ports CDH=NetF2_cdh7_2 GND=GND VCC8=VCC8
cdh8: designators end in _cdh8; ports CDH=NetF2_cdh8_2 GND=GND VCC8=VCC8

### Library data of the parts
C2 = Cap Semi: Capacitor (Semiconductor SIM Model); Published: 8-Jun-2000; LatestRevisionDate: 29-May-2009; LatestRevisionNote: IPC-7351 Footprint Added.; PackageReference: C1206; Publisher: Altium Limited; PackageDescription: Chip Capacitor
D2 = LED0: Typical INFRARED GaAs LED; Published: 8-Jun-2000; LatestRevisionDate: 08-Jul-2005; LatestRevisionNote: Mech Layer 1 removed.; PackageReference: LED-0; Publisher: Altium Limited; PackageDescription: LED; 2 Leads
F2 = Fuse 1: Fuse; Published: 8-Jun-2000; LatestRevisionDate: 17-Jul-2002; LatestRevisionNote: Re-released for DXP Platform.; PackageReference: PIN-W2/E2.8; Publisher: Altium Limited; PackageDescription: Thru-Hole; 2 Leads
Q2 = NPN: NPN Bipolar Transistor; Published: 8-Jun-2000; LatestRevisionDate: 17-Jul-2002; LatestRevisionNote: Re-released for DXP Platform.; PackageReference: TO-226-AA; Publisher: Altium Limited; PackageDescription: TO, Flat Index; 3 In-Line, Axial Leads; Body Dia. 4.8mm; Leads 0.55 x 0.51 mm (max); Code_JEDEC: TO-226-AA
R3 R4 R6 R12-R14 R16 R18 R20 R22 R24 R26 = Res2: Resistor; Published: 8-Jun-2000; LatestRevisionDate: 17-Jul-2002; LatestRevisionNote: Re-released for DXP Platform.; PackageReference: AXIAL-0.4; Publisher: Altium Limited; PackageDescription: Axial Device, Thru-Hole; 2 Leads; 0.4 in Pin Spacing
R8 = Res Tap: as R7 on sheet 磁导航20161011; Published: 24-Mar-1999; LatestRevisionDate: 17-Jul-2002; LatestRevisionNote: Re-released for DXP Platform.; PackageReference: VR3; Publisher: Altium Limited; PackageDescription: Variable Resistor, Thru-Hole; 3 Leads
U5 = Header 4: Header, 4-Pin; LatestRevisionDate: 17-Jul-2002; LatestRevisionNote: Re-released for DXP Platform.; Publisher: Altium Limited

## Nets that join several sheets
GND: 磁导航20161011 (45 pins), 总图 (5 pins), cdh1 (5 pins), cdh2 (5 pins), cdh3 (5 pins), cdh4 (5 pins), cdh5 (5 pins), cdh6 (5 pins), cdh7 (5 pins), cdh8 (5 pins)
VCC8: 磁导航20161011 (35 pins), 总图 (C4#2.1 C5#2.2 U1#2.3), cdh1 (C2_cdh1.2 R24_cdh1.2 U3_cdh1.1 U19_cdh1.4), cdh2 (C2_cdh2.2 R24_cdh2.2 U3_cdh2.1 U19_cdh2.4), cdh3 (C2_cdh3.2 R24_cdh3.2 U3_cdh3.1 U19_cdh3.4), cdh4 (C2_cdh4.2 R24_cdh4.2 U3_cdh4.1 U19_cdh4.4), cdh5 (C2_cdh5.2 R24_cdh5.2 U3_cdh5.1 U19_cdh5.4), cdh6 (C2_cdh6.2 R24_cdh6.2 U3_cdh6.1 U19_cdh6.4), cdh7 (C2_cdh7.2 R24_cdh7.2 U3_cdh7.1 U19_cdh7.4), cdh8 (C2_cdh8.2 R24_cdh8.2 U3_cdh8.1 U19_cdh8.4)
VCC24: 磁导航20161011 (D3#1.1 P1#1.10), 总图 (D3#2.1 P1#2.10)